# Altium project PCB_V72_FPGA.PrjPcb
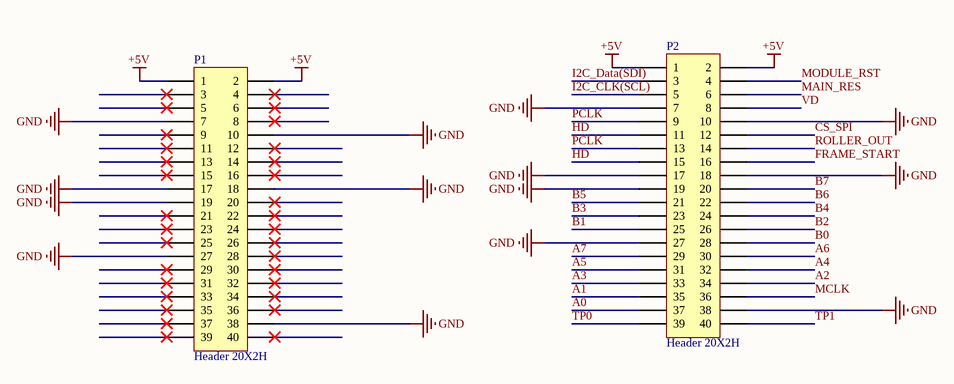
[diagram p0: V72_FPGA.SchDoc]
1 sheet, 2 parts. Net scope: global (net labels, ports and power ports of the same name join across sheets).
Board file: V72_FPGA样版.PcbDoc

## Sheet V72_FPGA.SchDoc
size A4

### Parts
P1  Header 20X2H  [HDR2X20H]
P2  Header 20X2H  [HDR2X20H]

### Nets
+5V: P1.1 P1.2 P2.1 P2.2
GND: P1.7 P1.10 P1.17 P1.18 P1.19 P1.27 P1.38 P2.7 P2.10 P2.17 P2.18 P2.19 P2.27 P2.38
A0: P2.37
A1: P2.35
A2: P2.34
A3: P2.33
A4: P2.32
A5: P2.31
A6: P2.30
A7: P2.29
B0: P2.28
B1: P2.25
B2: P2.26
B3: P2.23
B4: P2.24
B5: P2.21
B6: P2.22
B7: P2.20
CS_SPI: P2.12
FRAME_START: P2.16
HD: P2.11 P2.15
I2C_CLK(SCL): P2.5
I2C_Data(SDI): P2.3
MAIN_RES: P2.6
MCLK: P2.36
MODULE_RST: P2.4
PCLK: P2.9 P2.13
ROLLER_OUT: P2.14
TP0: P2.39
TP1: P2.40
VD: P2.8

Not connected (* = marked no-connect by the designer): P1 3* 4* 5* 6* 8* 9* 11* 12* 13* 14* 15* 16* 20* 21* 22* 23* 24* 25* 26* 28* 29* 30* 31* 32* 33* 34* 35* 36* 37* 39* 40*

### Library data of the parts
P1 P2 = Header 20X2H: Header, 20-Pin, Dual row, Right Angle; LatestRevisionDate: 17-Jul-2002; LatestRevisionNote: Re-released for DXP Platform.; Publisher: Altium Limited